# EAGLE design lcd-i2c (EAGLE 6.4)
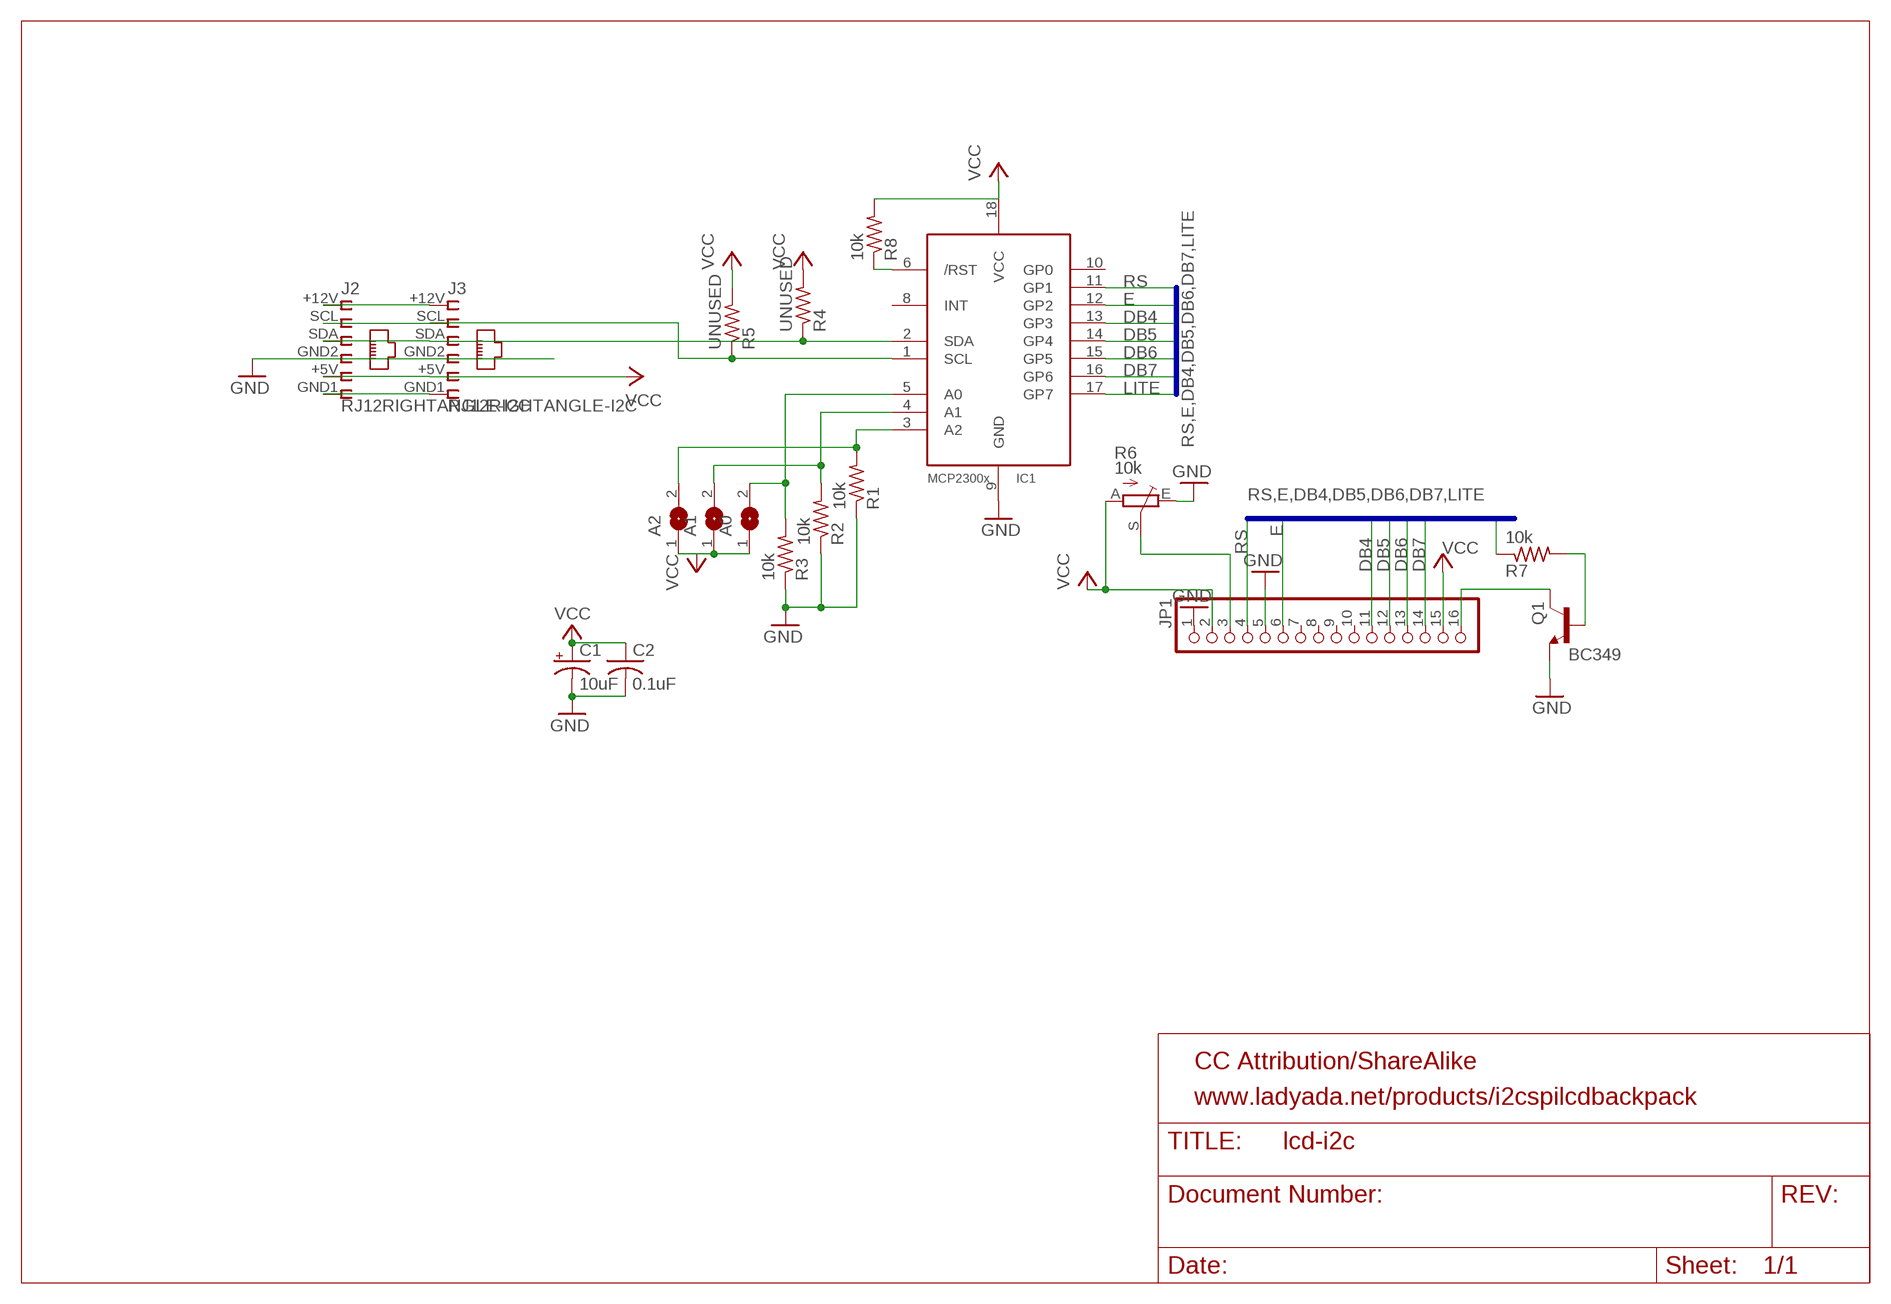
[diagram p0: schematic, sheet 1]

## Parts
A0  SJ  [SJ]
A1  SJ  [SJ]
A2  SJ  [SJ]
C1  10uF  CPOL-USA/3216-18R  [A/3216-18R]
C2  0.1uF  C-USC1206  [C1206]
IC1  MCP2300X/P  [DIL18]
J2  RJ12RIGHTANGLE-I2C  [RJ12-RIGHTANGLE-I2C]
J3  RJ12RIGHTANGLE-I2C  [RJ12-RIGHTANGLE-I2C]
JP1  PINHD-1X16  [1X16]
Q1  BC349  BC317-NPN-TO92-EBC  [TO92-EBC]
R1  10k  R-US_M1206  [M1206]
R2  10k  R-US_M1206  [M1206]
R3  10k  R-US_M1206  [M1206]
R4  UNUSED  R-US_M1206  [M1206]
R5  UNUSED  R-US_M1206  [M1206]
R6  10k  TRIM_EU-CA6V  [CA6V]
R7  10k  R-US_M1206  [M1206]
R8  10k  R-US_M1206  [M1206]

## Nets
CLOCK: IC1.1(SCL) J2.SCL J3.SCL R5.1
DATA: IC1.2(SDA) J2.SDA J3.SDA R4.1
DB4: IC1.13(GP3) JP1.11
DB5: IC1.14(GP4) JP1.12
DB6: IC1.15(GP5) JP1.13
DB7: IC1.16(GP6) JP1.14
E: IC1.12(GP2) JP1.6
GND [power]: C1.- C2.2 IC1.9(GND) J2.GND2 J3.GND2 JP1.1 JP1.5 Q1.E R1.1 R2.1 R3.1 R6.E
LITE: IC1.17(GP7) R7.1
N$1: A0.2 IC1.5(A0) R3.2
N$2: A1.2 IC1.4(A1) R2.2
N$3: A2.2 IC1.3(A2) R1.2
N$4 [power]: J2.+12V J3.+12V
N$5 [power]: IC1.6(/RST) R8.1
N$7: JP1.16 Q1.C
N$9: Q1.B R7.2
N$10: JP1.3 R6.S
N$11 [power]: J2.GND1 J3.GND1
RS: IC1.11(GP1) JP1.4
VCC [power]: A0.1 A1.1 A2.1 C1.+ C2.1 IC1.18(VCC) J2.+5V J3.+5V JP1.2 JP1.15 R4.2 R5.2 R6.A R8.2
Unconnected: IC1.8(INT) IC1.10(GP0) JP1.7 JP1.8 JP1.9 JP1.10

## Buses
RS,E,DB4,DB5,DB6,DB7,LITE

## Notes on the sheet
- CC Attribution/ShareAlike
- www.ladyada.net/products/i2cspilcdbackpack

## Library data of the parts
A0 A1 A2 = jumper:SJ: SMD solder JUMPER
C1 = adafruit:CPOL-US: POLARIZED CAPACITOR, American symbol
C2 = adafruit:C-US: CAPACITOR, American symbol
IC1 = adafruit:MCP2300X: MCP23008 Inexpensive i2c i/o expander - 8 general purpose i/o pins with optional pullups
J2 J3 = lpatiny:RJ12: CORCOM Modular RJ Jacks No Shield Source: www.tycoelectronics.com .. ENG_DS_1654001_1099_RJ_L_0507.pdf
JP1 = pinhead:PINHD-1X16: PIN HEADER
Q1 = transistor:*-NPN-: NPN Transistror BF959 corrected 2008.03.06
R1-R5 R7 R8 = adafruit:R-US_: RESISTOR, American symbol
R6 = pot:TRIM_EU-: POTENTIOMETER

## Net classes
0 default: width 0.4 mm
1 power: width 0.8 mm

## Board
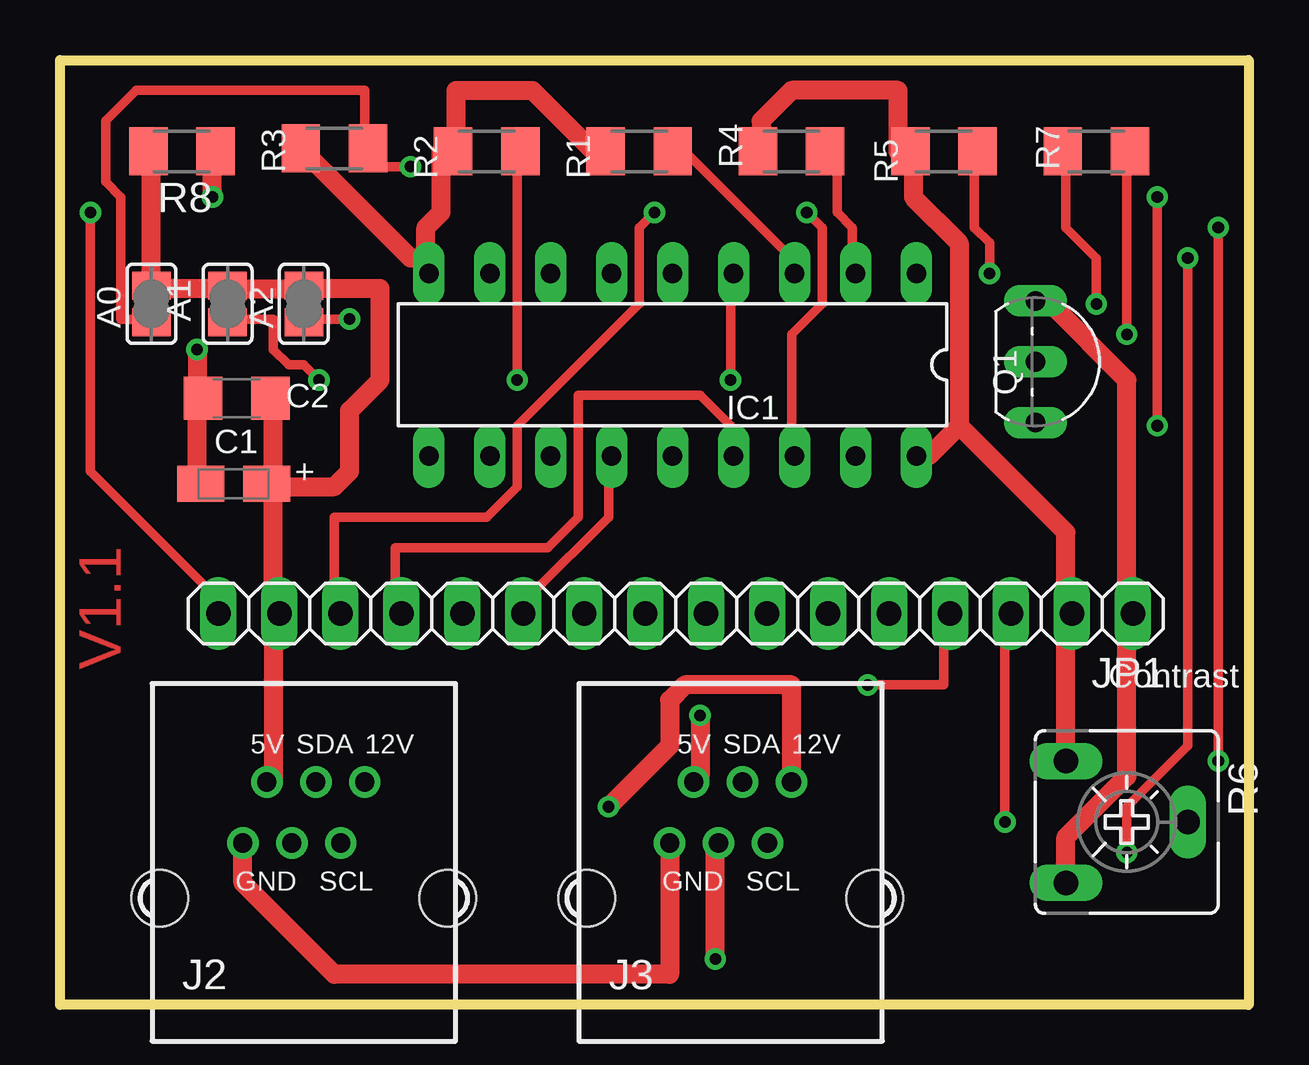
[diagram p1: board, top side]
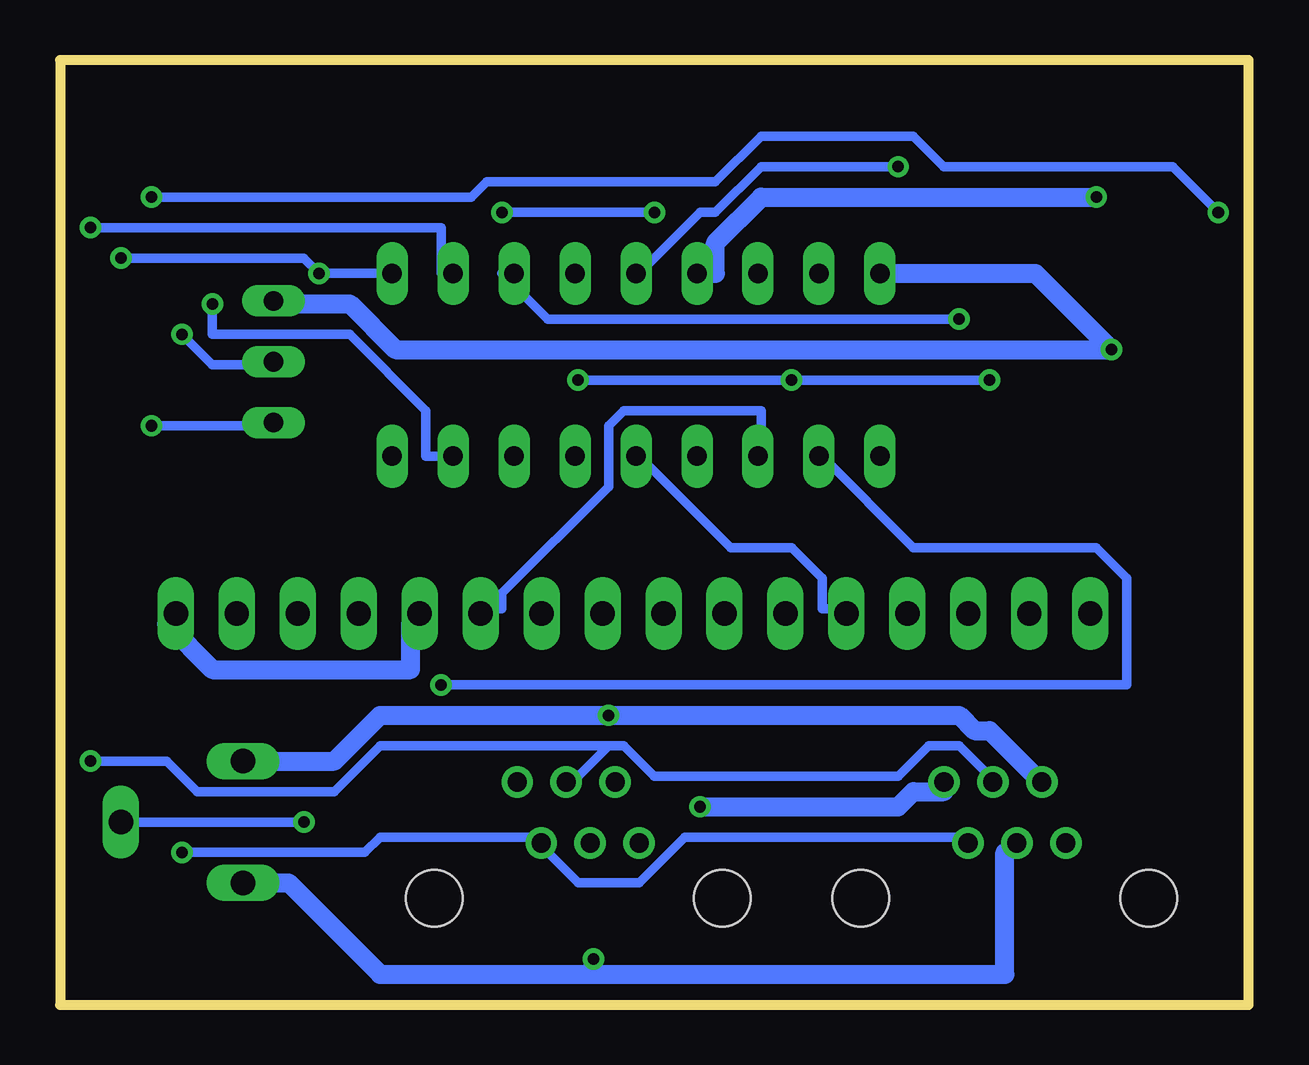
[diagram p2: board, bottom side, seen from below]

Size 49.53 x 39.37 mm. Coordinates in mm from the lower left corner, seen from the top.
Outline: 0,0 0,39.37 49.53,39.37 49.53,0 0,0
Copper layers (1*16): Top 0.035mm / dielectric 1.5mm / Bottom 0.035mm
Design rules "default": minimum track width 10mil, minimum drill 19mil, track to track 10mil, track to pad 10mil, pad to pad 10mil, via to via 10mil, smd to smd 10mil, copper to edge 20mil, drill to drill 8mil, minimum pad ring 10mil, minimum via ring 8mil, stop-mask expansion 4mil, vias tented up to drill 20mil, thermal gap 10mil
Milling: 4 lines

### Footprints (pad centres in the part's own frame; a part is rotated, then mirrored left to right if it is on the bottom)
SJ = smd 1.168 x 1.6: 1 -0.762,0; 2 0.762,0
A/3216-18R = smd 1.95 x 1.5: + 1.375,0; - -1.375,0
C1206 = smd 1.6 x 1.8: 1 -1.4,0; 2 1.4,0
DIL18 = drill 0.813 long: 1 -10.16,-3.81; 2 -7.62,-3.81; 3 -5.08,-3.81; 4 -2.54,-3.81; 5 0,-3.81; 6 2.54,-3.81; 7 5.08,-3.81; 8 7.62,-3.81; 9 10.16,-3.81; 10 10.16,3.81; 11 7.62,3.81; 12 5.08,3.81; 13 2.54,3.81; 14 0,3.81; 15 -2.54,3.81; 16 -5.08,3.81; 17 -7.62,3.81; 18 -10.16,3.81
RJ12-RIGHTANGLE-I2C = drill 0.8 pad 1.3: +5V -1.54,4.84; +12V 2.54,4.84; GND1 -2.54,2.3; GND2 -0.5,2.3; SCL 1.54,2.3; SDA 0.5,4.84 | hole 2.36: -6,0; 6,0
1X16 = drill 1.016 long: 1 -19.05,0; 2 -16.51,0; 3 -13.97,0; 4 -11.43,0; 5 -8.89,0; 6 -6.35,0; 7 -3.81,0; 8 -1.27,0; 9 1.27,0; 10 3.81,0; 11 6.35,0; 12 8.89,0; 13 11.43,0; 14 13.97,0; 15 16.51,0; 16 19.05,0
TO92-EBC = drill 0.813 long: B 0,-1.27; C 2.54,-1.27; E -2.54,-1.27
M1206 = smd 1.6 x 2: 1 -1.4,0; 2 1.4,0
CA6V = drill 1.016 long: A -2.54,-2.54; E 2.54,-2.54; S 0,2.54

### Placement (x,y rotation side)
A0  3.81,29.21 270 top
A1  6.99,29.21 270 top
A2  10.16,29.21 270 top
C1  7.24,21.72 0 top
C2  7.37,25.27 180 top
IC1  25.53,26.67 180 top
J2  10.16,4.45 0 top
J3  27.94,4.45 0 top
JP1  25.65,16.31 180 top
Q1  41.91,26.8 270 top
R1  24.13,35.56 0 top
R2  17.78,35.56 0 top
R3  11.43,35.69 0 top
R4  30.48,35.56 180 top
R5  36.83,35.56 180 top
R6  44.45,7.62 270 top
R7  43.18,35.56 0 top
R8  5.08,35.56 180 top

### Tracks (layer width: path | path; a pad name or v marks a point on that pad's centre or on a via)
CLOCK  (via drill 0.48)
  Top 0.4: v38.73,30.48 38.73,31.75 38.1,32.38 38.1,35.56 R5.1 | v46.99,31.11 46.99,10.79 44.45,8.26 v44.45,6.35
  Bottom 0.4: IC1.1 v38.73,30.48 39.37,31.11 v46.99,31.11 | J2.SCL 12.06,6.99 23.5,6.99 25.4,5.08 27.94,5.08 29.21,6.35 J3.SCL 29.84,6.99 36.2,6.99 36.83,6.35 v44.45,6.35
DATA  (via drill 0.48)
  Top 0.4: R4.1 32.38,35.56 32.38,33.02 33.02,32.38 33.02,30.48 IC1.2 | v48.26,10.16 v48.26,32.38
  Bottom 0.4: 26.67,10.79 27.94,9.53 J3.SDA | 26.67,10.79 26.04,10.79 24.77,9.53 14.61,9.53 13.34,10.79 12.06,10.79 10.79,9.53 J2.SDA | v48.26,32.38 33.66,32.38 33.66,30.48 IC1.2 | v48.26,10.16 45.09,10.16 43.81,8.89 38.1,8.89 36.2,10.79 26.67,10.79
DB4
  Top 0.4: IC1.13 22.86,22.86 22.86,20.32 19.68,17.14 19.68,16.51 JP1.11
DB5
  Bottom 0.4: IC1.14 25.4,22.86 21.59,19.05 19.05,19.05 17.78,17.78 17.78,16.51 17.14,16.51 JP1.12
DB6
  Top 0.4: IC1.15 27.94,22.86 27.94,24.13 26.67,25.4 21.59,25.4 21.59,20.32 20.32,19.05 13.97,19.05 13.97,16.51 JP1.13
DB7  (via drill 0.48)
  Top 0.4: v31.11,33.02 31.75,32.38 31.75,29.21 30.48,27.94 30.48,22.86 IC1.16 | v24.77,33.02 24.13,32.38 24.13,29.21 19.05,24.13 19.05,21.59 17.78,20.32 11.43,20.32 11.43,16.51 JP1.14
  Bottom 0.4: v24.77,33.02 v31.11,33.02
E
  Bottom 0.4: IC1.12 20.32,22.86 20.32,24.77 26.04,24.77 26.67,24.13 26.67,21.59 31.11,17.14 31.11,16.51 31.75,16.51 JP1.6
GND  (via drill 0.48)
  Top 0.8: C1.- 5.71,22.23 5.71,24.77 C2.2 5.71,25.4 v5.71,27.3 | 15.24,31.11 14.61,31.11 10.16,35.56 R3.1 | 15.24,31.11 15.24,30.48 IC1.9 15.24,31.11 | 15.24,31.11 15.24,32.38 15.88,33.02 15.88,35.56 R2.1 16.51,35.56 16.51,38.1 19.68,38.1 22.23,35.56 R1.1 | Q1.E 40.64,29.21 41.27,29.21 44.45,26.04 44.45,16.51 JP1.1 44.45,15.88 44.45,9.53 41.91,6.99 R6.E | v27.3,1.91 27.3,6.35 J3.GND2
  Bottom 0.8: IC1.9 8.89,30.48 v5.71,27.3 35.56,27.3 37.47,29.21 40.64,29.21 Q1.E | JP1.5 34.92,15.88 34.92,13.97 43.18,13.97 45.09,15.88 JP1.1 | 27.3,1.27 36.2,1.27 40.01,5.08 R6.E | 27.3,1.27 10.16,1.27 10.16,6.35 J2.GND2 | 27.3,1.27 v27.3,1.91
LITE  (via drill 0.48)
  Top 0.4: v43.18,29.21 43.18,31.11 41.91,32.38 41.91,35.56 R7.1
  Bottom 0.4: v43.18,29.21 43.18,27.94 37.47,27.94 34.29,24.77 34.29,22.86 IC1.17
N$1  (via drill 0.48)
  Top 0.4: A0.2 3.81,28.57 2.54,28.57 2.54,33.66 1.91,34.29 1.91,36.83 3.17,38.1 12.7,38.1 12.7,36.2 R3.2 13.34,35.56 13.34,34.92 v14.61,34.92
  Bottom 0.4: v14.61,34.92 20.32,34.92 22.23,33.02 22.86,33.02 25.4,30.48 IC1.5
N$2  (via drill 0.48)
  Top 0.4: v10.79,26.04 10.16,26.67 9.53,26.67 8.89,27.3 8.89,28.57 6.99,28.57 A1.2 | v27.94,26.04 27.94,30.48 IC1.4 | v19.05,26.04 19.05,35.56 R2.2
  Bottom 0.4: v27.94,26.04 v19.05,26.04 v10.79,26.04
N$3  (via drill 0.48)
  Top 0.4: v12.06,28.57 10.16,28.57 A2.2 | R1.2 26.04,35.56 30.48,31.11 30.48,30.48 IC1.3
  Bottom 0.4: v12.06,28.57 29.21,28.57 31.11,30.48 IC1.3
N$4  (via drill 0.48)
  Top 0.8: v22.86,8.26 25.4,10.79 25.4,12.7 26.04,13.34 30.48,13.34 J3.+12V
  Bottom 0.8: v22.86,8.26 14.61,8.26 13.97,8.89 12.7,8.89 J2.+12V
N$5  (via drill 0.48)
  Top 0.8: v6.35,33.66 6.35,35.56 R8.1
  Bottom 0.8: v6.35,33.66 20.32,33.66 22.23,31.75 22.23,30.48 IC1.6
N$7  (via drill 0.48)
  Top 0.4: v45.72,33.66 v45.72,24.13 | v1.27,33.02 1.27,22.23 6.35,17.14 6.35,16.51 JP1.16
  Bottom 0.4: v45.72,24.13 40.64,24.13 Q1.C | v45.72,33.66 32.38,33.66 31.75,34.29 22.23,34.29 20.32,36.2 13.97,36.2 12.7,34.92 3.17,34.92 v1.27,33.02
N$9  (via drill 0.48)
  Top 0.4: v44.45,27.94 44.45,35.56 R7.2
  Bottom 0.4: v44.45,27.94 43.18,26.67 40.64,26.67 Q1.B
N$10  (via drill 0.48)
  Top 0.4: v39.37,7.62 39.37,15.88 JP1.3
  Bottom 0.4: v39.37,7.62 R6.S
N$11
  Top 0.8: J2.GND1 7.62,5.08 11.43,1.27 25.4,1.27 J3.GND1
RS  (via drill 0.48)
  Top 0.4: v33.66,13.34 36.83,13.34 36.83,15.88 JP1.4
  Bottom 0.4: v33.66,13.34 5.08,13.34 5.08,17.78 6.35,19.05 13.97,19.05 17.78,22.86 IC1.11
VCC  (via drill 0.48)
  Top 0.8: 6.99,29.84 3.81,29.84 A0.1 3.81,35.56 R8.2 | 6.99,29.84 10.16,29.84 | 6.99,29.84 A1.1 | C2.1 8.89,24.77 8.89,22.23 C1.+ 8.89,21.59 | J2.+5V 8.89,9.53 8.89,15.88 JP1.15 8.89,16.51 8.89,21.59 | 10.16,29.84 13.34,29.84 13.34,26.04 12.06,24.77 12.06,22.23 11.43,21.59 8.89,21.59 | 10.16,29.84 A2.1 | R4.2 29.21,35.56 29.21,36.83 30.48,38.1 34.92,38.1 34.92,35.56 R5.2 35.56,35.56 35.56,33.66 37.47,31.75 37.47,24.13 | 37.47,24.13 36.2,22.86 IC1.18 | R6.A 41.91,15.88 JP1.2 41.91,16.51 41.91,19.68 37.47,24.13 | v26.67,12.06 26.67,9.53 J3.+5V
  Bottom 0.8: R6.A 38.1,10.16 36.2,12.06 v26.67,12.06 12.06,12.06 11.43,11.43 10.79,11.43 8.89,9.53 J2.+5V

### Text on the board
Top: V1.1
tPlace: Contrast